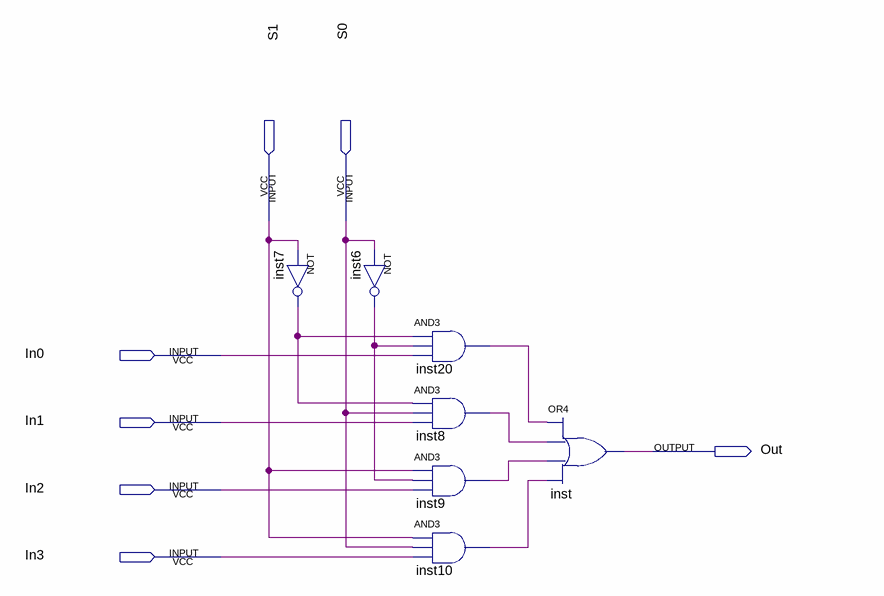
[diagram p0: schematic sheet]
// Quartus schematic Mux4to1.bdf as structural Verilog: 7 symbols, 7 pins
module Mux4to1 (
  input  S1,
  input  S0,
  input  In0,
  input  In1,
  input  In2,
  input  In3,
  output Out
);

  wire inst6_out, inst7_out, inst8_out, inst9_out, inst10_out, inst20_out;

  not inst7 (inst7_out, S1);
  not inst6 (inst6_out, S0);
  and inst20 (inst20_out, inst7_out, inst6_out, In0);
  and inst8 (inst8_out, inst7_out, S0, In1);
  and inst9 (inst9_out, S1, inst6_out, In2);
  and inst10 (inst10_out, S1, S0, In3);
  or inst (Out, inst20_out, inst8_out, inst9_out, inst10_out);
endmodule
